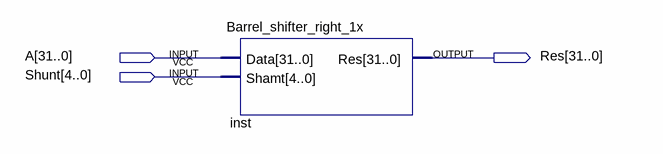
[diagram p0: schematic sheet]
// Quartus schematic SRA.bdf as structural Verilog: 1 symbols, 3 pins
module SRA (
  input  [31:0] A,
  input  [4:0] Shunt,
  output [31:0] Res
);

  Barrel_shifter_right_1x inst (.Data(A), .Shamt(Shunt), .Res(Res));
endmodule
